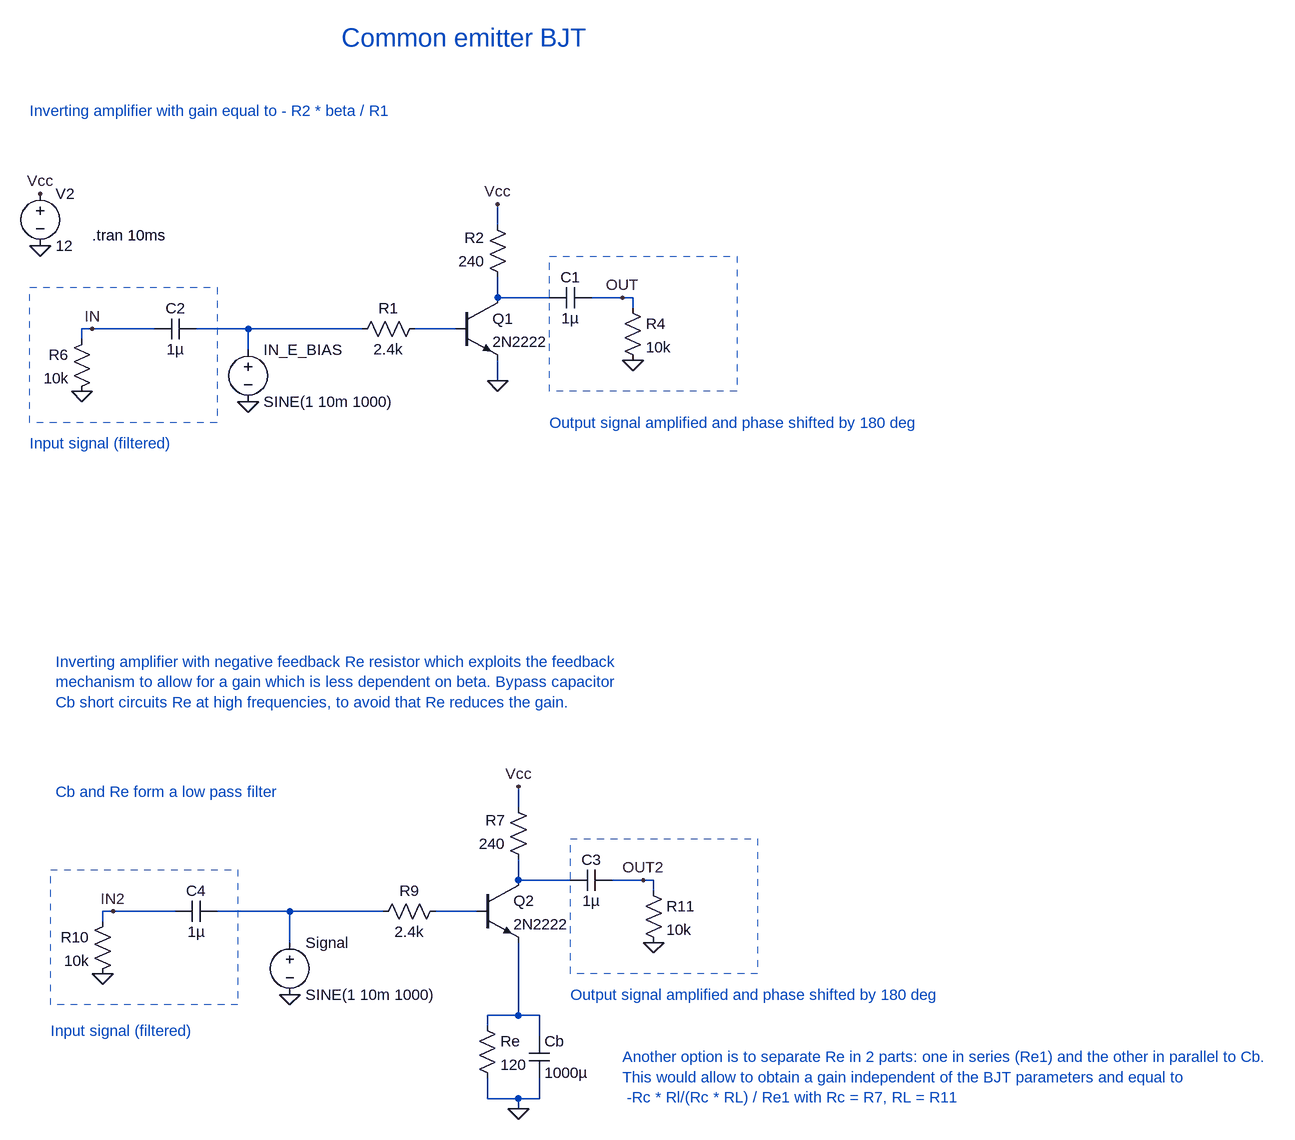
[diagram p0: schematic Common-emitter-BJT.asc]
Common-emitter-BJT.asc, the LTspice schematic file:
Version 4
SHEET 1 1828 1396
WIRE 384 16 384 -16
WIRE 384 128 384 96
WIRE 464 128 384 128
WIRE 576 128 528 128
WIRE 592 128 576 128
WIRE 592 144 592 128
WIRE -240 176 -256 176
WIRE -144 176 -240 176
WIRE 0 176 -80 176
WIRE 176 176 0 176
WIRE 320 176 256 176
WIRE -256 192 -256 176
WIRE 0 208 0 176
WIRE 384 256 384 224
WIRE 416 912 416 880
WIRE 416 1024 416 992
WIRE 496 1024 416 1024
WIRE 608 1024 560 1024
WIRE 624 1024 608 1024
WIRE 624 1040 624 1024
WIRE -208 1072 -224 1072
WIRE -112 1072 -208 1072
WIRE 64 1072 -48 1072
WIRE 208 1072 64 1072
WIRE 352 1072 288 1072
WIRE -224 1088 -224 1072
WIRE 64 1120 64 1072
WIRE 416 1232 416 1120
WIRE 416 1232 368 1232
WIRE 448 1232 416 1232
WIRE 368 1248 368 1232
WIRE 448 1264 448 1232
WIRE 368 1360 368 1328
WIRE 416 1360 368 1360
WIRE 448 1360 448 1328
WIRE 448 1360 416 1360
WIRE 416 1376 416 1360
FLAG 384 256 0
FLAG -320 48 0
FLAG -320 -32 Vcc
FLAG 384 -16 Vcc
FLAG 576 128 OUT
FLAG 592 224 0
FLAG -240 176 IN
FLAG -256 272 0
FLAG 416 880 Vcc
FLAG 608 1024 OUT2
FLAG 624 1120 0
FLAG -208 1072 IN2
FLAG -224 1168 0
FLAG 0 288 0
FLAG 64 1200 0
FLAG 416 1376 0
SYMBOL voltage 0 192 R0
WINDOW 123 0 0 Left 2
WINDOW 39 0 0 Left 2
SYMATTR InstName IN_E_BIAS
SYMATTR Value SINE(1 10m 1000)
SYMBOL res 272 160 R90
WINDOW 0 0 56 VBottom 2
WINDOW 3 32 56 VTop 2
SYMATTR InstName R1
SYMATTR Value 2.4k
SYMBOL res 400 112 R180
WINDOW 0 36 76 Left 2
WINDOW 3 36 40 Left 2
SYMATTR InstName R2
SYMATTR Value 240
SYMBOL npn 320 128 R0
SYMATTR InstName Q1
SYMATTR Value 2N2222
SYMBOL voltage -320 -48 R0
WINDOW 123 0 0 Left 2
WINDOW 39 0 0 Left 2
SYMATTR InstName V2
SYMATTR Value 12
SYMBOL cap 528 112 R90
WINDOW 0 0 32 VBottom 2
WINDOW 3 32 32 VTop 2
SYMATTR InstName C1
SYMATTR Value 1µ
SYMBOL res 576 128 R0
SYMATTR InstName R4
SYMATTR Value 10k
SYMBOL cap -144 160 M90
WINDOW 0 0 32 VBottom 2
WINDOW 3 32 32 VTop 2
SYMATTR InstName C2
SYMATTR Value 1µ
SYMBOL res -240 176 M0
SYMATTR InstName R6
SYMATTR Value 10k
SYMBOL res 304 1056 R90
WINDOW 0 0 56 VBottom 2
WINDOW 3 32 56 VTop 2
SYMATTR InstName R9
SYMATTR Value 2.4k
SYMBOL res 432 1008 R180
WINDOW 0 36 76 Left 2
WINDOW 3 36 40 Left 2
SYMATTR InstName R7
SYMATTR Value 240
SYMBOL npn 352 1024 R0
SYMATTR InstName Q2
SYMATTR Value 2N2222
SYMBOL cap 560 1008 R90
WINDOW 0 0 32 VBottom 2
WINDOW 3 32 32 VTop 2
SYMATTR InstName C3
SYMATTR Value 1µ
SYMBOL res 608 1024 R0
SYMATTR InstName R11
SYMATTR Value 10k
SYMBOL cap -112 1056 M90
WINDOW 0 0 32 VBottom 2
WINDOW 3 32 32 VTop 2
SYMATTR InstName C4
SYMATTR Value 1µ
SYMBOL res -208 1072 M0
SYMATTR InstName R10
SYMATTR Value 10k
SYMBOL voltage 64 1104 R0
WINDOW 123 0 0 Left 2
WINDOW 39 0 0 Left 2
SYMATTR InstName Signal
SYMATTR Value SINE(1 10m 1000)
SYMBOL res 352 1232 R0
SYMATTR InstName Re
SYMATTR Value 120
SYMBOL cap 432 1264 R0
SYMATTR InstName Cb
SYMATTR Value 1000µ
TEXT -240 32 Left 2 !.tran 10ms
TEXT -336 352 Left 2 ;Input signal (filtered)
TEXT 464 320 Left 2 ;Output signal amplified and phase shifted by 180 deg
TEXT -336 -160 Left 2 ;Inverting amplifier with gain equal to - R2 * beta / R1
TEXT -296 688 Left 2 ;Inverting amplifier with negative feedback Re resistor which exploits the feedback\nmechanism to allow for a gain which is less dependent on beta. Bypass capacitor\nCb short circuits Re at high frequencies, to avoid that Re reduces the gain.
TEXT -296 888 Left 2 ;Cb and Re form a low pass filter
TEXT 576 1296 Left 2 ;Another option is to separate Re in 2 parts: one in series (Re1) and the other in parallel to Cb.\nThis would allow to obtain a gain independent of the BJT parameters and equal to\n -Rc * Rl/(Rc * RL) / Re1 with Rc = R7, RL = R11
TEXT -304 1256 Left 2 ;Input signal (filtered)
TEXT 496 1200 Left 2 ;Output signal amplified and phase shifted by 180 deg
TEXT 144 -272 Left 4 ;Common emitter BJT
RECTANGLE Normal 752 272 464 64 2
RECTANGLE Normal -48 320 -336 112 2
RECTANGLE Normal 784 1168 496 960 2
RECTANGLE Normal -16 1216 -304 1008 2

The netlist it stands for:
* Common-emitter-BJT.asc
V§IN_E_BIAS N002 0 SINE(1 10m 1000)
R1 N003 N002 2.4k
R2 N001 Vcc 240
Q1 N001 N003 0 0 2N2222
V2 Vcc 0 12
C1 OUT N001 1µ
R4 OUT 0 10k
C2 IN N002 1µ
R6 IN 0 10k
R9 N006 N005 2.4k
R7 N004 Vcc 240
Q2 N004 N006 N007 0 2N2222
C3 OUT2 N004 1µ
R11 OUT2 0 10k
C4 IN2 N005 1µ
R10 IN2 0 10k
V§Signal N005 0 SINE(1 10m 1000)
Re N007 0 120
Cb N007 0 1000µ
.model NPN NPN
.model PNP PNP
.lib standard.bjt
.tran 10ms
* Input signal (filtered)
* Output signal amplified and phase shifted by 180 deg
* Inverting amplifier with gain equal to - R2 * beta / R1
* Inverting amplifier with negative feedback Re resistor which exploits the feedback
* mechanism to allow for a gain which is less dependent on beta. Bypass capacitor
* Cb short circuits Re at high frequencies, to avoid that Re reduces the gain.
* Cb and Re form a low pass filter
* Another option is to separate Re in 2 parts: one in series (Re1) and the other in parallel to Cb.
* This would allow to obtain a gain independent of the BJT parameters and equal to
*  -Rc * Rl/(Rc * RL) / Re1 with Rc = R7, RL = R11
* Input signal (filtered)
* Output signal amplified and phase shifted by 180 deg
* Common emitter BJT
.backanno
.end